# Altium schematic sheet TLV62569_SingleChannel.SchDoc
size A4
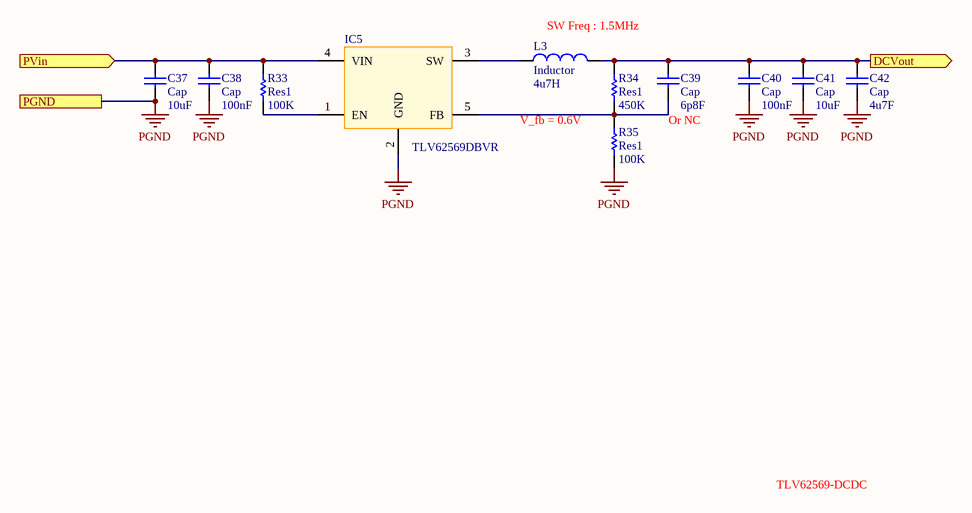
[diagram p0: TLV62569_SingleChannel.SchDoc]

## Parts
C37  Cap  value 10uF  [0603C]
C38  Cap  value 100nF  [0603C]
C39  Cap  value 6p8F  [0603C]
C40  Cap  value 100nF  [0603C]
C41  Cap  value 10uF  [0603C]
C42  Cap  value 4u7F  [0603C]
IC5  TLV62569DBVR  [SOT95P280X145-5N]
L3  Inductor  value 4u7H  [0402-A]
R33  Res1  value 100K  [0603R]
R34  Res1  value 450K  [0603R]
R35  Res1  value 100K  [0603R]

## Ports
DCVout (out), PGND, PVin (in)

## Nets
PGND: C37.1 C38.1 C40.1 C41.1 C42.1 IC5.2(GND) R35.1 ; port PGND
DCVout: C39.2 C40.2 C41.2 C42.2 L3.2 R34.2 ; port DCVout
PVin: C37.2 C38.2 IC5.4(VIN) R33.2 ; port PVin
NetC39_1: C39.1 IC5.5(FB) R34.1 R35.2
NetIC5_1: IC5.1(EN) R33.1
NetIC5_3: IC5.3(SW) L3.1

## Notes on the sheet
- SW Freq : 1.5MHz
- V_fb = 0.6V
- (near C39) Or NC
- TLV62569-DCDC

## Library data of the parts
C37-C42 = Cap: Capacitor; Published: 8-Jun-2000; LatestRevisionDate: 17-Jul-2002; LatestRevisionNote: Re-released for DXP Platform.; PackageReference: RAD-0.3; Publisher: Altium Limited; PackageDescription: Radial Cap, Thru-Hole; 2 Leads; 0.3 in Pin Spacing
IC5 = TLV62569DBVR: Buck DC-DC; 2.5-V to 5.5-V Input Voltage Range; 95% Efficiency;Output Voltage from 0.6 V to VIN; / SOT-23-5; Manufacturer_Name: Texas Instruments; Datasheet Link: http://www.ti.com/lit/gpn/tlv62569; Height: 1.45mm; Manufacturer_Part_Number: TLV62569DBVR; Mouser Part Number: 595-TLV62569DBVR; Mouser Price/Stock: https://www.mouser.co.uk/ProductDetail/Texas-Instruments/TLV62569DBVR?qs=0C8XhJW8e4oaylc%252BzBrCmA%3D%3D; Arrow Part Number: TLV62569DBVR; Arrow Price/Stock: https://www.arrow.com/en/products/tlv62569dbvr/texas-instruments?region=nac
L3 = Inductor: Code_IEC: 1005; Published: 8-Jun-2000; LatestRevisionDate: 29-May-2009; LatestRevisionNote: IPC-7351 Footprint Added.; PackageReference: 0402-A; Publisher: Altium Limited; PackageDescription: Chip Inductor; Code_JEITA: 0402
R33-R35 = Res1: Resistor; Published: 8-Jun-2000; LatestRevisionDate: 17-Jul-2002; LatestRevisionNote: Re-released for DXP Platform.; PackageReference: AXIAL-0.3; Publisher: Altium Limited; PackageDescription: Axial Device, Thru-Hole; 2 Leads; 0.3 in Pin Spacing